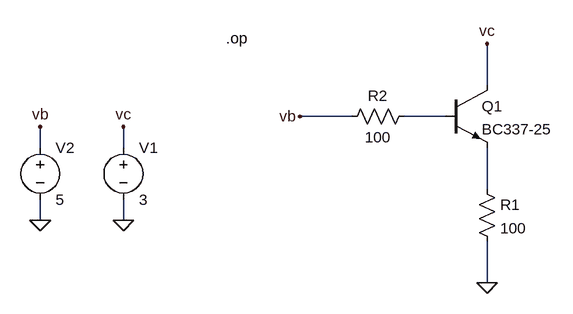
[diagram p0: schematic npn.asc]
npn.asc, the LTspice schematic file:
Version 4
SHEET 1 880 680
WIRE 656 48 656 -16
WIRE 448 96 368 96
WIRE 592 96 528 96
WIRE -32 144 -32 112
WIRE 96 144 96 112
WIRE 656 208 656 144
WIRE -32 256 -32 224
WIRE 96 256 96 224
WIRE 656 352 656 288
FLAG 96 256 0
FLAG -32 256 0
FLAG -32 112 vb
FLAG 96 112 vc
FLAG 656 352 0
FLAG 656 -16 vc
FLAG 368 96 vb
SYMBOL voltage 96 128 R0
WINDOW 123 0 0 Left 2
WINDOW 39 0 0 Left 2
SYMATTR InstName V1
SYMATTR Value 3
SYMBOL voltage -32 128 R0
SYMATTR InstName V2
SYMATTR Value 5
SYMBOL npn 592 48 R0
SYMATTR InstName Q1
SYMATTR Value BC337-25
SYMBOL res 640 192 R0
SYMATTR InstName R1
SYMATTR Value 100
SYMATTR SpiceLine tol=1 pwr=0.1
SYMBOL res 544 80 R90
WINDOW 0 0 56 VBottom 2
WINDOW 3 32 56 VTop 2
SYMATTR InstName R2
SYMATTR Value 100
SYMATTR SpiceLine tol=1 pwr=0.1
TEXT 254 -24 Left 2 !.op

The netlist it stands for:
* npn.asc
V1 vc 0 3
V2 vb 0 5
Q1 vc N001 N002 0 BC337-25
R1 N002 0 100 tol=1 pwr=0.1
R2 N001 vb 100 tol=1 pwr=0.1
.model NPN NPN
.model PNP PNP
.lib standard.bjt
.op
.backanno
.end